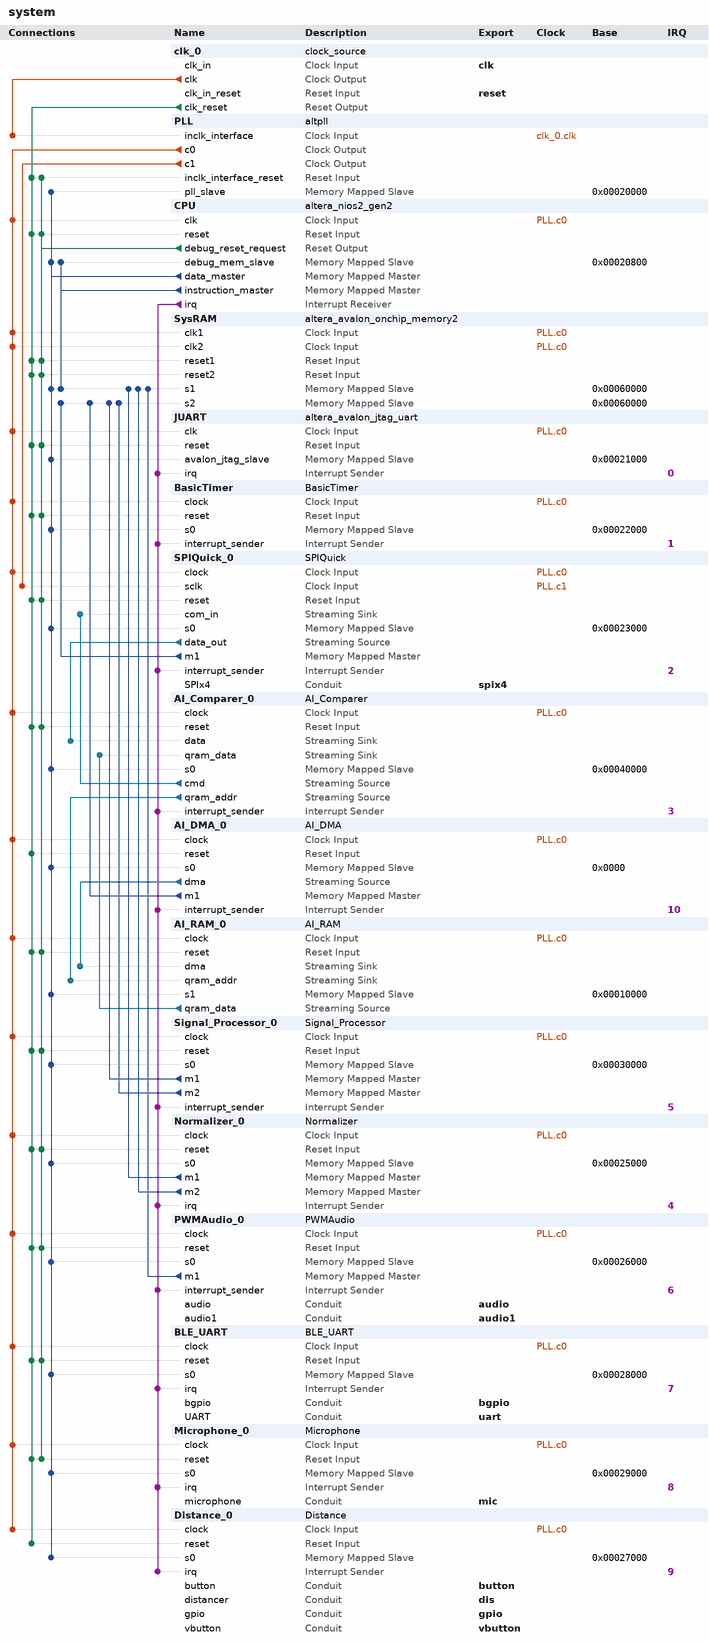
[diagram p0: system contents]
# Platform Designer (Qsys) system system, MAX 10 10M50DAF484C7G
# Parameters at their usual value, and those the tool derives, are not listed.
package require -exact qsys 18.1
create_system system
set_project_property DEVICE_FAMILY {MAX 10}
set_project_property DEVICE 10M50DAF484C7G

add_instance clk_0 clock_source 18.1
set_instance_parameter_value clk_0 clockFrequency 50000000

add_instance PLL altpll 18.1
set_instance_parameter_value PLL CLK0_DIVIDE_BY 1
set_instance_parameter_value PLL CLK0_MULTIPLY_BY 2
set_instance_parameter_value PLL CLK1_DIVIDE_BY 1
set_instance_parameter_value PLL CLK1_DUTY_CYCLE 50
set_instance_parameter_value PLL CLK1_MULTIPLY_BY 4
set_instance_parameter_value PLL CLK1_PHASE_SHIFT 0
set_instance_parameter_value PLL CLK2_DIVIDE_BY 25
set_instance_parameter_value PLL CLK2_DUTY_CYCLE 50
set_instance_parameter_value PLL CLK2_MULTIPLY_BY 1
set_instance_parameter_value PLL CLK2_PHASE_SHIFT 0
set_instance_parameter_value PLL INCLK0_INPUT_FREQUENCY 20000
set_instance_parameter_value PLL PORT_ARESET PORT_USED
set_instance_parameter_value PLL PORT_LOCKED PORT_USED
set_instance_parameter_value PLL PORT_clk1 PORT_USED
set_instance_parameter_value PLL PORT_clk2 PORT_UNUSED
set_instance_parameter_value PLL PORT_clk3 PORT_UNUSED

add_instance CPU altera_nios2_gen2 18.1
set_instance_parameter_value CPU dcache_size 2048
set_instance_parameter_value CPU exceptionSlave SysRAM.s1
set_instance_parameter_value CPU icache_size 4096
set_instance_parameter_value CPU impl Tiny
set_instance_parameter_value CPU mul_32_impl 0
set_instance_parameter_value CPU mul_shift_choice 1
set_instance_parameter_value CPU resetSlave SysRAM.s1

add_instance SysRAM altera_avalon_onchip_memory2 18.1
set_instance_parameter_value SysRAM blockType M9K
set_instance_parameter_value SysRAM dataWidth 32
set_instance_parameter_value SysRAM dualPort true
set_instance_parameter_value SysRAM initMemContent true
set_instance_parameter_value SysRAM initializationFileName C:/FPGA_Projects/SpeechAI/software/AI_Speech1/mem_init/system_SysRAM.hex
set_instance_parameter_value SysRAM memorySize 81920
set_instance_parameter_value SysRAM slave1Latency 2
set_instance_parameter_value SysRAM useNonDefaultInitFile true

add_instance JUART altera_avalon_jtag_uart 18.1
set_instance_parameter_value JUART simInteractiveOptions NO_INTERACTIVE_WINDOWS
set_instance_parameter_value JUART useRegistersForReadBuffer true
set_instance_parameter_value JUART useRegistersForWriteBuffer true

add_instance BasicTimer BasicTimer 1.0
set_instance_parameter_value BasicTimer TIME_MAX 100000

add_instance SPIQuick_0 SPIQuick 1.0

add_instance AI_Comparer_0 AI_Comparer 1.0

add_instance AI_DMA_0 AI_DMA 1.0

add_instance AI_RAM_0 AI_RAM 1.0

add_instance Signal_Processor_0 Signal_Processor 1.0

add_instance Normalizer_0 Normalizer 1.0

add_instance PWMAudio_0 PWMAudio 1.0

add_instance BLE_UART BLE_UART 1.0

add_instance Microphone_0 Microphone 1.0

add_instance Distance_0 Distance 1.0

# connections
add_connection clk_0.clk PLL.inclk_interface clock
add_connection PLL.c0 AI_Comparer_0.clock clock
add_connection PLL.c0 AI_DMA_0.clock clock
add_connection PLL.c0 AI_RAM_0.clock clock
add_connection PLL.c0 BasicTimer.clock clock
add_connection PLL.c0 BLE_UART.clock clock
add_connection PLL.c0 CPU.clk clock
add_connection PLL.c0 Distance_0.clock clock
add_connection PLL.c0 JUART.clk clock
add_connection PLL.c0 Microphone_0.clock clock
add_connection PLL.c0 Normalizer_0.clock clock
add_connection PLL.c0 PWMAudio_0.clock clock
add_connection PLL.c0 Signal_Processor_0.clock clock
add_connection PLL.c0 SPIQuick_0.clock clock
add_connection PLL.c0 SysRAM.clk1 clock
add_connection PLL.c0 SysRAM.clk2 clock
add_connection PLL.c1 SPIQuick_0.sclk clock
add_connection clk_0.clk_reset AI_Comparer_0.reset reset
add_connection clk_0.clk_reset AI_DMA_0.reset reset
add_connection clk_0.clk_reset AI_RAM_0.reset reset
add_connection clk_0.clk_reset BasicTimer.reset reset
add_connection clk_0.clk_reset BLE_UART.reset reset
add_connection clk_0.clk_reset CPU.reset reset
add_connection clk_0.clk_reset Distance_0.reset reset
add_connection clk_0.clk_reset JUART.reset reset
add_connection clk_0.clk_reset Microphone_0.reset reset
add_connection clk_0.clk_reset Normalizer_0.reset reset
add_connection clk_0.clk_reset PLL.inclk_interface_reset reset
add_connection clk_0.clk_reset PWMAudio_0.reset reset
add_connection clk_0.clk_reset Signal_Processor_0.reset reset
add_connection clk_0.clk_reset SPIQuick_0.reset reset
add_connection clk_0.clk_reset SysRAM.reset1 reset
add_connection clk_0.clk_reset SysRAM.reset2 reset
add_connection CPU.debug_reset_request AI_Comparer_0.reset reset
add_connection CPU.debug_reset_request AI_RAM_0.reset reset
add_connection CPU.debug_reset_request BasicTimer.reset reset
add_connection CPU.debug_reset_request BLE_UART.reset reset
add_connection CPU.debug_reset_request CPU.reset reset
add_connection CPU.debug_reset_request JUART.reset reset
add_connection CPU.debug_reset_request Microphone_0.reset reset
add_connection CPU.debug_reset_request Normalizer_0.reset reset
add_connection CPU.debug_reset_request PLL.inclk_interface_reset reset
add_connection CPU.debug_reset_request PWMAudio_0.reset reset
add_connection CPU.debug_reset_request Signal_Processor_0.reset reset
add_connection CPU.debug_reset_request SPIQuick_0.reset reset
add_connection CPU.debug_reset_request SysRAM.reset1 reset
add_connection CPU.debug_reset_request SysRAM.reset2 reset
add_connection AI_DMA_0.m1 SysRAM.s2 avalon
set_connection_parameter_value AI_DMA_0.m1/SysRAM.s2 baseAddress 0x00060000
add_connection CPU.data_master AI_Comparer_0.s0 avalon
set_connection_parameter_value CPU.data_master/AI_Comparer_0.s0 baseAddress 0x00040000
add_connection CPU.data_master AI_DMA_0.s0 avalon
set_connection_parameter_value CPU.data_master/AI_DMA_0.s0 baseAddress 0x0000
add_connection CPU.data_master AI_RAM_0.s1 avalon
set_connection_parameter_value CPU.data_master/AI_RAM_0.s1 baseAddress 0x00010000
add_connection CPU.data_master BasicTimer.s0 avalon
set_connection_parameter_value CPU.data_master/BasicTimer.s0 baseAddress 0x00022000
add_connection CPU.data_master BLE_UART.s0 avalon
set_connection_parameter_value CPU.data_master/BLE_UART.s0 baseAddress 0x00028000
add_connection CPU.data_master CPU.debug_mem_slave avalon
set_connection_parameter_value CPU.data_master/CPU.debug_mem_slave baseAddress 0x00020800
add_connection CPU.data_master Distance_0.s0 avalon
set_connection_parameter_value CPU.data_master/Distance_0.s0 baseAddress 0x00027000
add_connection CPU.data_master JUART.avalon_jtag_slave avalon
set_connection_parameter_value CPU.data_master/JUART.avalon_jtag_slave baseAddress 0x00021000
add_connection CPU.data_master Microphone_0.s0 avalon
set_connection_parameter_value CPU.data_master/Microphone_0.s0 baseAddress 0x00029000
add_connection CPU.data_master Normalizer_0.s0 avalon
set_connection_parameter_value CPU.data_master/Normalizer_0.s0 baseAddress 0x00025000
add_connection CPU.data_master PLL.pll_slave avalon
set_connection_parameter_value CPU.data_master/PLL.pll_slave baseAddress 0x00020000
add_connection CPU.data_master PWMAudio_0.s0 avalon
set_connection_parameter_value CPU.data_master/PWMAudio_0.s0 baseAddress 0x00026000
add_connection CPU.data_master Signal_Processor_0.s0 avalon
set_connection_parameter_value CPU.data_master/Signal_Processor_0.s0 baseAddress 0x00030000
add_connection CPU.data_master SPIQuick_0.s0 avalon
set_connection_parameter_value CPU.data_master/SPIQuick_0.s0 baseAddress 0x00023000
add_connection CPU.data_master SysRAM.s1 avalon
set_connection_parameter_value CPU.data_master/SysRAM.s1 baseAddress 0x00060000
add_connection CPU.instruction_master CPU.debug_mem_slave avalon
set_connection_parameter_value CPU.instruction_master/CPU.debug_mem_slave baseAddress 0x00020800
add_connection CPU.instruction_master SysRAM.s1 avalon
set_connection_parameter_value CPU.instruction_master/SysRAM.s1 baseAddress 0x00060000
add_connection Normalizer_0.m1 SysRAM.s1 avalon
set_connection_parameter_value Normalizer_0.m1/SysRAM.s1 baseAddress 0x00060000
add_connection Normalizer_0.m2 SysRAM.s1 avalon
set_connection_parameter_value Normalizer_0.m2/SysRAM.s1 baseAddress 0x00060000
add_connection PWMAudio_0.m1 SysRAM.s1 avalon
set_connection_parameter_value PWMAudio_0.m1/SysRAM.s1 baseAddress 0x00060000
add_connection Signal_Processor_0.m1 SysRAM.s2 avalon
set_connection_parameter_value Signal_Processor_0.m1/SysRAM.s2 baseAddress 0x00060000
add_connection Signal_Processor_0.m2 SysRAM.s2 avalon
set_connection_parameter_value Signal_Processor_0.m2/SysRAM.s2 baseAddress 0x00060000
add_connection SPIQuick_0.m1 SysRAM.s2 avalon
set_connection_parameter_value SPIQuick_0.m1/SysRAM.s2 baseAddress 0x00060000
add_connection AI_Comparer_0.cmd SPIQuick_0.com_in avalon_streaming
add_connection AI_Comparer_0.qram_addr AI_RAM_0.qram_addr avalon_streaming
add_connection AI_DMA_0.dma AI_RAM_0.dma avalon_streaming
add_connection AI_RAM_0.qram_data AI_Comparer_0.qram_data avalon_streaming
add_connection SPIQuick_0.data_out AI_Comparer_0.data avalon_streaming
add_connection CPU.irq AI_Comparer_0.interrupt_sender interrupt
set_connection_parameter_value CPU.irq/AI_Comparer_0.interrupt_sender irqNumber 3
add_connection CPU.irq AI_DMA_0.interrupt_sender interrupt
set_connection_parameter_value CPU.irq/AI_DMA_0.interrupt_sender irqNumber 10
add_connection CPU.irq BasicTimer.interrupt_sender interrupt
set_connection_parameter_value CPU.irq/BasicTimer.interrupt_sender irqNumber 1
add_connection CPU.irq BLE_UART.irq interrupt
set_connection_parameter_value CPU.irq/BLE_UART.irq irqNumber 7
add_connection CPU.irq Distance_0.irq interrupt
set_connection_parameter_value CPU.irq/Distance_0.irq irqNumber 9
add_connection CPU.irq JUART.irq interrupt
set_connection_parameter_value CPU.irq/JUART.irq irqNumber 0
add_connection CPU.irq Microphone_0.irq interrupt
set_connection_parameter_value CPU.irq/Microphone_0.irq irqNumber 8
add_connection CPU.irq Normalizer_0.irq interrupt
set_connection_parameter_value CPU.irq/Normalizer_0.irq irqNumber 4
add_connection CPU.irq PWMAudio_0.interrupt_sender interrupt
set_connection_parameter_value CPU.irq/PWMAudio_0.interrupt_sender irqNumber 6
add_connection CPU.irq Signal_Processor_0.interrupt_sender interrupt
set_connection_parameter_value CPU.irq/Signal_Processor_0.interrupt_sender irqNumber 5
add_connection CPU.irq SPIQuick_0.interrupt_sender interrupt
set_connection_parameter_value CPU.irq/SPIQuick_0.interrupt_sender irqNumber 2

# exported interfaces
add_interface audio conduit end
set_interface_property audio EXPORT_OF PWMAudio_0.audio
add_interface audio1 conduit end
set_interface_property audio1 EXPORT_OF PWMAudio_0.audio1
add_interface bgpio conduit end
set_interface_property bgpio EXPORT_OF BLE_UART.bgpio
add_interface button conduit end
set_interface_property button EXPORT_OF Distance_0.button
add_interface clk clock sink
set_interface_property clk EXPORT_OF clk_0.clk_in
add_interface dis conduit end
set_interface_property dis EXPORT_OF Distance_0.distancer
add_interface gpio conduit end
set_interface_property gpio EXPORT_OF Distance_0.gpio
add_interface mic conduit end
set_interface_property mic EXPORT_OF Microphone_0.microphone
add_interface reset reset sink
set_interface_property reset EXPORT_OF clk_0.clk_in_reset
add_interface spix4 conduit end
set_interface_property spix4 EXPORT_OF SPIQuick_0.SPIx4
add_interface uart conduit end
set_interface_property uart EXPORT_OF BLE_UART.UART
add_interface vbutton conduit end
set_interface_property vbutton EXPORT_OF Distance_0.vbutton

set_interconnect_requirement {$system} qsys_mm.clockCrossingAdapter HANDSHAKE
set_interconnect_requirement {$system} qsys_mm.enableEccProtection FALSE
set_interconnect_requirement {$system} qsys_mm.insertDefaultSlave FALSE
set_interconnect_requirement {$system} qsys_mm.maxAdditionalLatency 1

save_system system.qsys
